# Altium schematic sheet up_floor.SchDoc
size A2
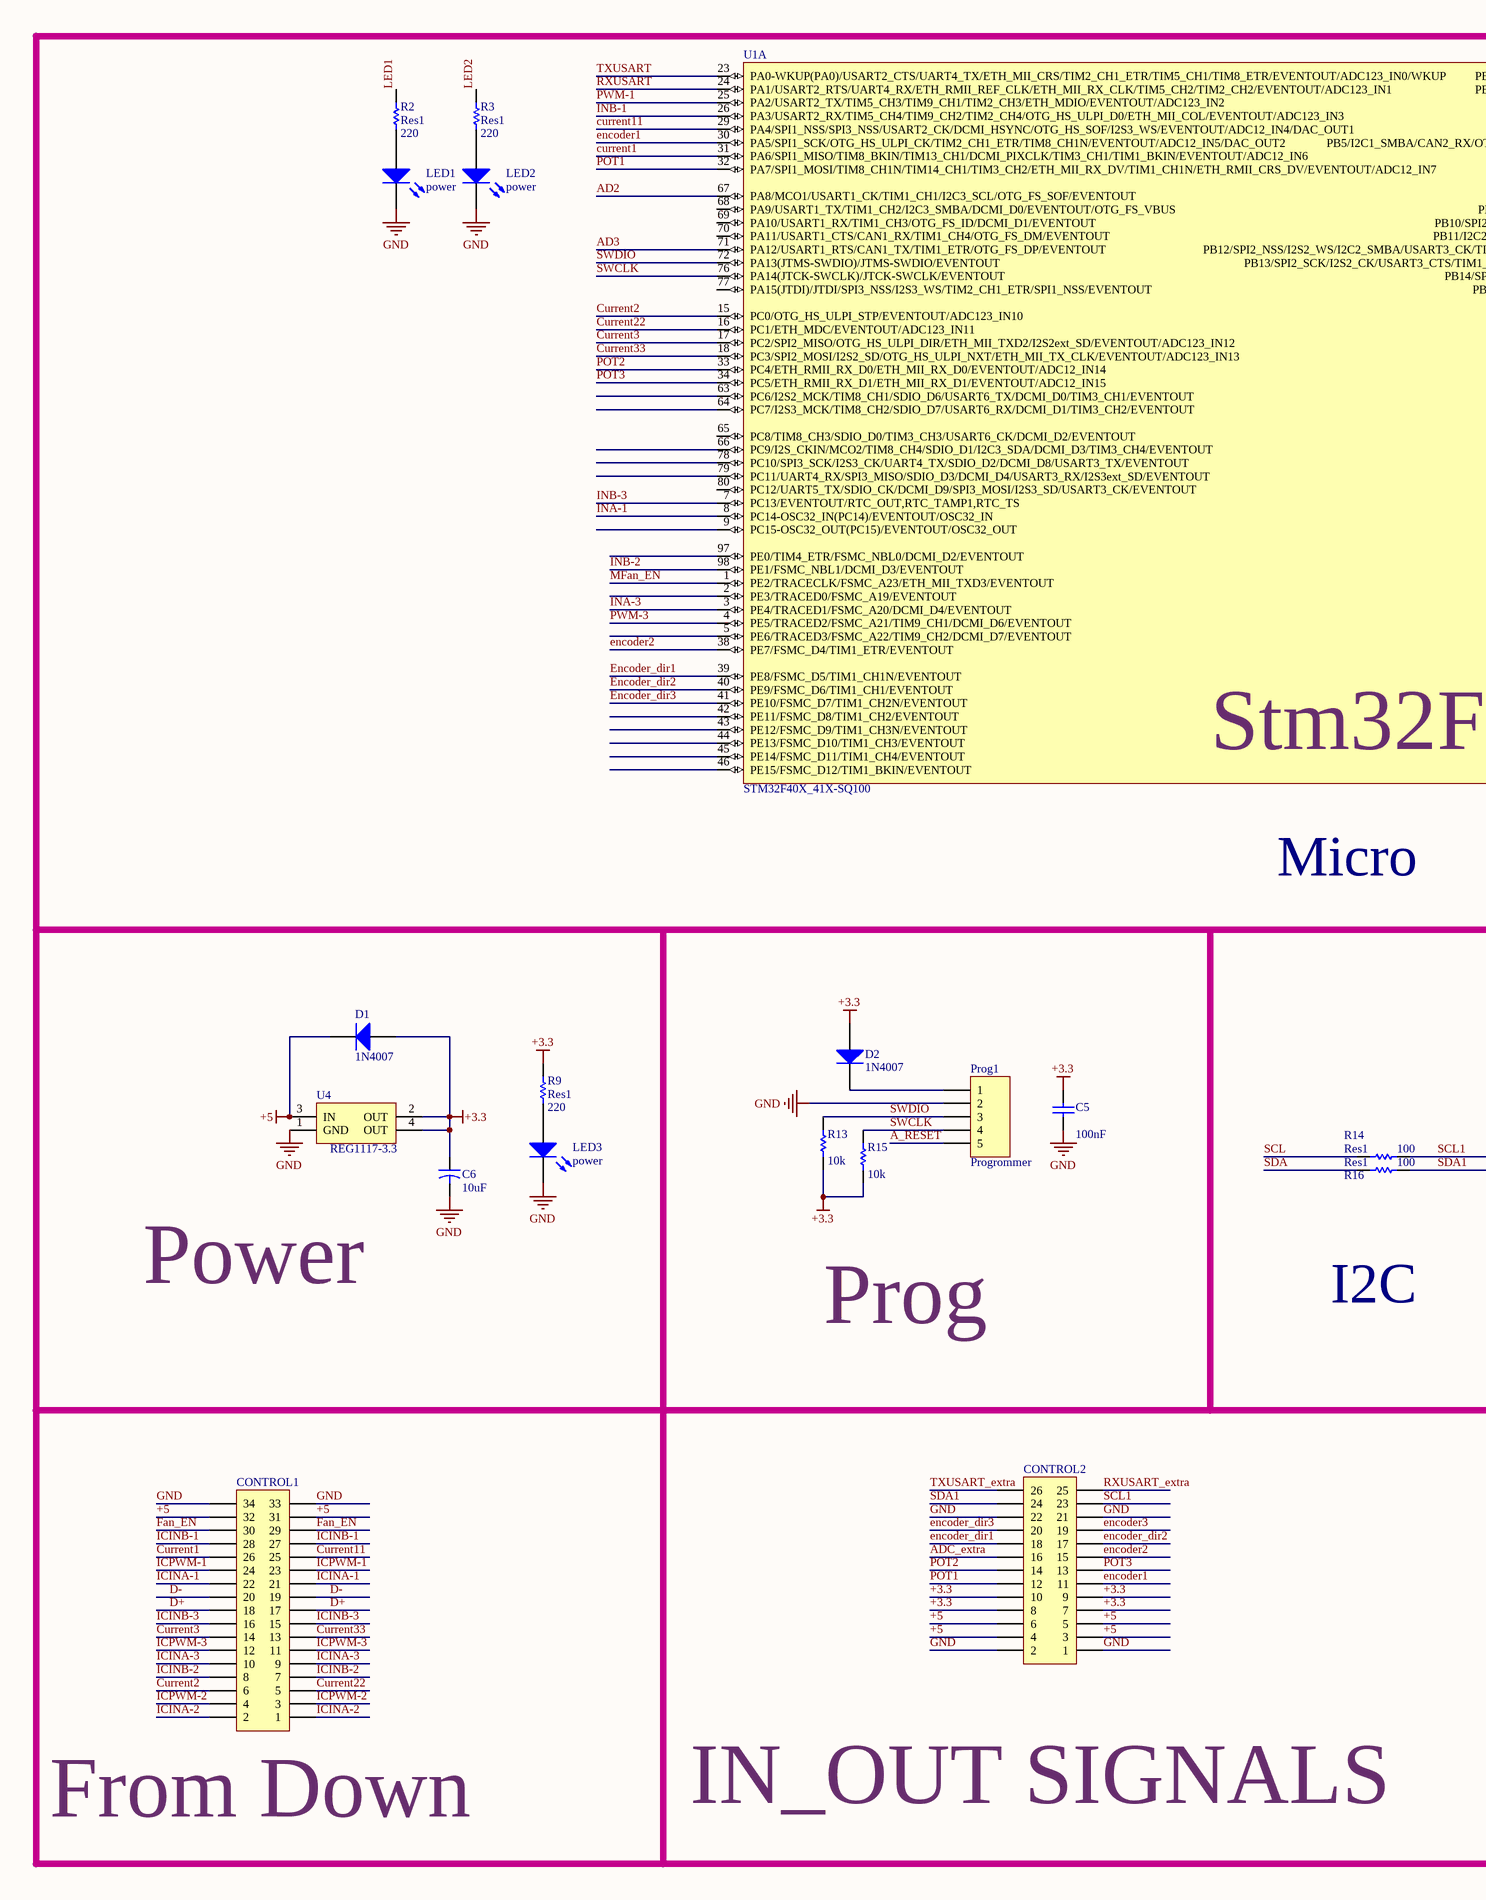
[diagram p0: up_floor.SchDoc, left]
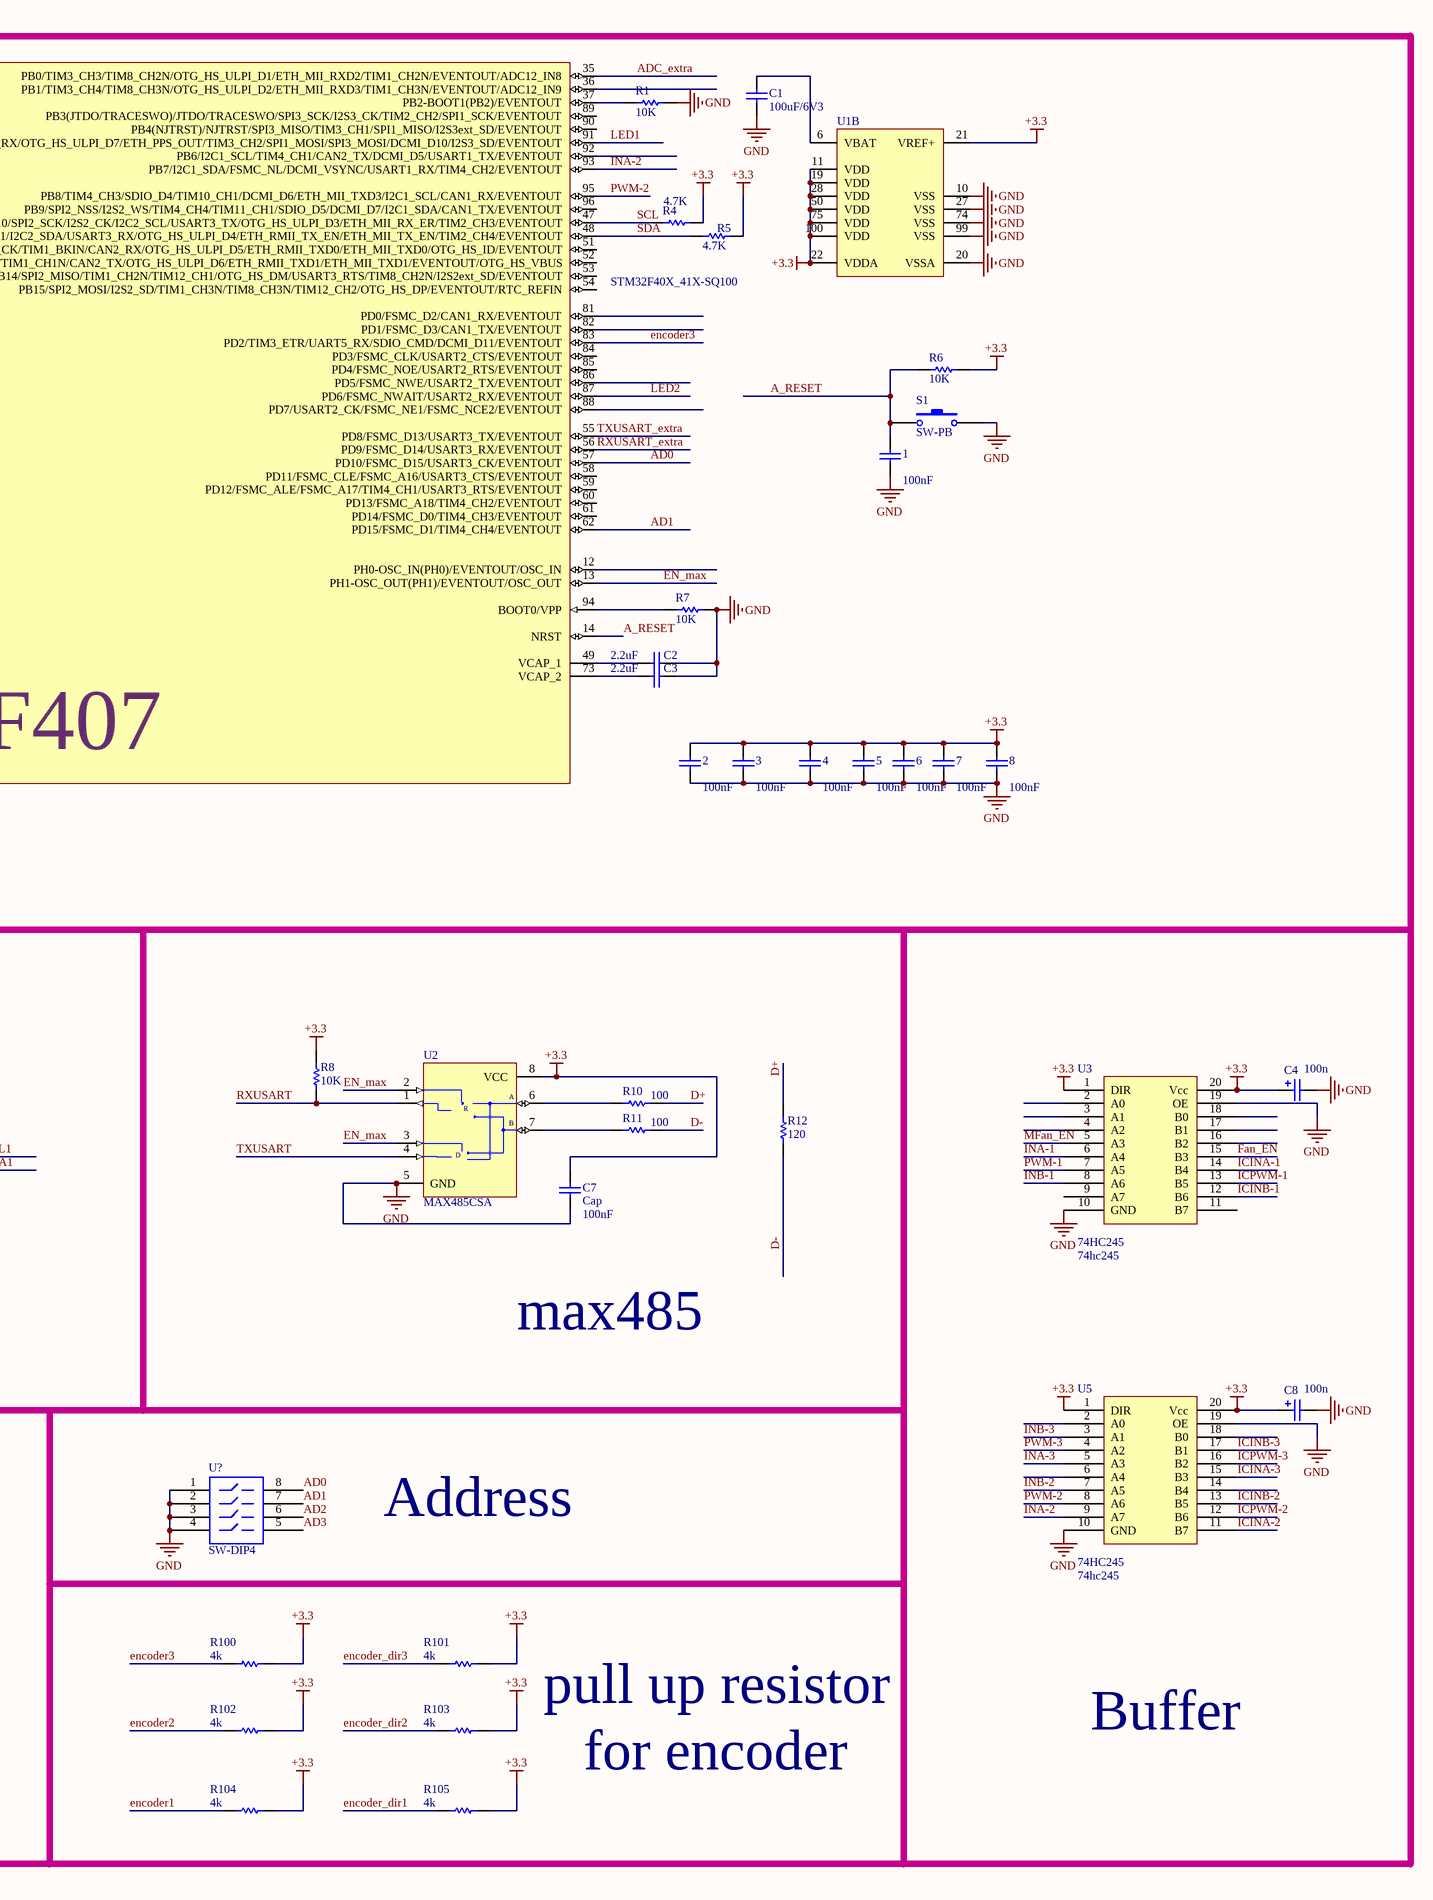
[diagram p1: up_floor.SchDoc, right]

## Parts
1  value 100nF  [j1-0603]
2  value 100nF  [j1-0603]
3  value 100nF  [j1-0603]
4  value 100nF  [j1-0603]
5  value 100nF  [j1-0603]
6  value 100nF  [j1-0603]
7  value 100nF  [j1-0603]
8  value 100nF  [j1-0603]
C1  100uF/6V3  [j1-0603]
C2  2.2uF  [j1-0603]
C3  2.2uF  [j1-0603]
C4  value 100n  [j1-0603]
C5  value 100nF  [j1-0603]
C6  value 10uF  [2012[0805]]  (hidden comment: Cap_El)
C7  Cap  value 100nF  [j1-0603]
C8  value 100n  [j1-0603]
CONTROL1  (no value)  [HDR2X17H]
CONTROL2  (no value)  [HDR2X13H]
D1  1N4007  [US1M]
D2  1N4007  [US1M]
LED1  power  [3518]
LED2  power  [3518]
LED3  power  [3518]
Prog1  Progrommer  [HDR1x5]
R1  10K  [J1-0603]
R2  Res1  value 220  [j1-0603]
R3  Res1  value 220  [j1-0603]
R4  4.7K  [J1-0603]
R5  4.7K  [J1-0603]
R6  10K  [J1-0603]
R7  10K  [J1-0603]
R8  value 10K  [j1-0603]  (hidden comment: Res1)
R9  Res1  value 220  [j1-0603]
R10  value 100  [j1-0603]  (hidden comment: Res1)
R11  value 100  [j1-0603]  (hidden comment: Res1)
R12  value 120  [j1-0603]  (hidden comment: Res1)
R13  value 10k  [J1-0603]
R14  Res1  value 100  [j1-0603]
R15  value 10k  [J1-0603]
R16  Res1  value 100  [j1-0603]
R100  4k  [j1-0603]
R101  4k  [j1-0603]
R102  4k  [j1-0603]
R103  4k  [j1-0603]
R104  4k  [j1-0603]
R105  4k  [j1-0603]
S1  SW-PB  [SW-PB-4P]
U1  STM32F40X_41X-SQ100  [100A_N]  (parts A,B of 2)
U2  MAX485CSA  [NSO8_N]
U3  74hc245  [74hc245]
U4  REG1117-3.3  [SOT223]
U5  74hc245  [74hc245]
U?  SW-DIP4  [SW_NUM_4PIN]

## Nets
+3.3: 2.2 3.2 4.2 5.2 6.2 7.2 8.2 C4.1 C5.2 C6.1 C7.2 C8.1 CONTROL2.7 CONTROL2.8 CONTROL2.9 CONTROL2.10 D1.1(A) D2.1(A) R4.1 R5.1 R6.1 R8.1 R9.1 R13.2 R15.2 R100.2 R101.2 R102.2 R103.2 R104.2 R105.2 U1.11(VDD) U1.19(VDD) U1.21(VREF+) U1.22(VDDA) U1.28(VDD) U1.50(VDD) U1.75(VDD) U1.100(VDD) U2.8(VCC) U3.1(DIR) U3.20(Vcc) U4.2(OUT) U4.4(OUT) U5.1(DIR) U5.20(Vcc)
+5: CONTROL1.31 CONTROL1.32 CONTROL2.3 CONTROL2.4 CONTROL2.5 CONTROL2.6 D1.2(K) U4.3(IN)
GND: 1.1 2.1 3.1 4.1 5.1 6.1 7.1 8.1 C1.1 C2.2 C3.2 C4.2 C5.1 C6.2 C7.1 C8.2 CONTROL1.33 CONTROL1.34 CONTROL2.1 CONTROL2.2 CONTROL2.21 CONTROL2.22 LED1.2(K) LED2.2(K) LED3.2(K) Prog1.2 R1.1 R7.1 S1.2 U1.10(VSS) U1.20(VSSA) U1.27(VSS) U1.74(VSS) U1.99(VSS) U2.5(GND) U3.10(GND) U3.19(OE) U4.1(GND) U5.10(GND) U5.19(OE) U?.1 U?.2 U?.3 U?.4
A_RESET: 1.2 Prog1.5 R6.2 S1.1 U1.14(NRST)
AD0: U1.57(PD10/FSMC_D15/USART3_CK/EVENTOUT) U?.8
AD1: U1.62(PD15/FSMC_D1/TIM4_CH4/EVENTOUT) U?.7
AD2: U1.67(PA8/MCO1/USART1_CK/TIM1_CH1/I2C3_SCL/OTG_FS_SOF/EVENTOUT) U?.6
AD3: U1.71(PA12/USART1_RTS/CAN1_TX/TIM1_ETR/OTG_FS_DP/EVENTOUT) U?.5
ADC_extra: CONTROL2.16 U1.35(PB0/TIM3_CH3/TIM8_CH2N/OTG_HS_ULPI_D1/ETH_MII_RXD2/TIM1_CH2N/EVENTOUT/ADC12_IN8)
Current1: CONTROL1.26 U1.31(PA6/SPI1_MISO/TIM8_BKIN/TIM13_CH1/DCMI_PIXCLK/TIM3_CH1/TIM1_BKIN/EVENTOUT/ADC12_IN6)
Current2: CONTROL1.6 U1.15(PC0/OTG_HS_ULPI_STP/EVENTOUT/ADC123_IN10)
Current3: CONTROL1.14 U1.17(PC2/SPI2_MISO/OTG_HS_ULPI_DIR/ETH_MII_TXD2/I2S2ext_SD/EVENTOUT/ADC123_IN12)
Current11: CONTROL1.25 U1.29(PA4/SPI1_NSS/SPI3_NSS/USART2_CK/DCMI_HSYNC/OTG_HS_SOF/I2S3_WS/EVENTOUT/ADC12_IN4/DAC_OUT1)
Current22: CONTROL1.5 U1.16(PC1/ETH_MDC/EVENTOUT/ADC123_IN11)
Current33: CONTROL1.13 U1.18(PC3/SPI2_MOSI/I2S2_SD/OTG_HS_ULPI_NXT/ETH_MII_TX_CLK/EVENTOUT/ADC123_IN13)
D+: CONTROL1.17 CONTROL1.18 R10.2 R12.1
D-: CONTROL1.19 CONTROL1.20 R11.2 R12.2
EN_max: U1.13(PH1-OSC_OUT(PH1)/EVENTOUT/OSC_OUT) U2.2(~{RE}) U2.3(DE)
encoder1: CONTROL2.11 R104.1 U1.30(PA5/SPI1_SCK/OTG_HS_ULPI_CK/TIM2_CH1_ETR/TIM8_CH1N/EVENTOUT/ADC12_IN5/DAC_OUT2)
encoder2: CONTROL2.15 R102.1 U1.38(PE7/FSMC_D4/TIM1_ETR/EVENTOUT)
encoder3: CONTROL2.19 R100.1 U1.83(PD2/TIM3_ETR/UART5_RX/SDIO_CMD/DCMI_D11/EVENTOUT)
encoder_dir1: CONTROL2.18 R105.1 U1.39(PE8/FSMC_D5/TIM1_CH1N/EVENTOUT)
encoder_dir2: CONTROL2.17 R103.1 U1.40(PE9/FSMC_D6/TIM1_CH1/EVENTOUT)
encoder_dir3: CONTROL2.20 R101.1 U1.41(PE10/FSMC_D7/TIM1_CH2N/EVENTOUT)
Fan_EN: CONTROL1.29 CONTROL1.30 U3.15(B3)
ICINA-1: CONTROL1.21 CONTROL1.22 U3.14(B4)
ICINA-2: CONTROL1.1 CONTROL1.2 U5.11(B7)
ICINA-3: CONTROL1.9 CONTROL1.10 U5.15(B3)
ICINB-1: CONTROL1.27 CONTROL1.28 U3.12(B6)
ICINB-2: CONTROL1.7 CONTROL1.8 U5.13(B5)
ICINB-3: CONTROL1.15 CONTROL1.16 U5.17(B1)
ICPWM-1: CONTROL1.23 CONTROL1.24 U3.13(B5)
ICPWM-2: CONTROL1.3 CONTROL1.4 U5.12(B6)
ICPWM-3: CONTROL1.11 CONTROL1.12 U5.16(B2)
INA-1: U1.8(PC14-OSC32_IN(PC14)/EVENTOUT/OSC32_IN) U3.6(A4)
INA-2: U1.93(PB7/I2C1_SDA/FSMC_NL/DCMI_VSYNC/USART1_RX/TIM4_CH2/EVENTOUT) U5.9(A7)
INA-3: U1.3(PE4/TRACED1/FSMC_A20/DCMI_D4/EVENTOUT) U5.5(A3)
INB-1: U1.26(PA3/USART2_RX/TIM5_CH4/TIM9_CH2/TIM2_CH4/OTG_HS_ULPI_D0/ETH_MII_COL/EVENTOUT/ADC123_IN3) U3.8(A6)
INB-2: U1.98(PE1/FSMC_NBL1/DCMI_D3/EVENTOUT) U5.7(A5)
INB-3: U1.7(PC13/EVENTOUT/RTC_OUT,RTC_TAMP1,RTC_TS) U5.3(A1)
LED1: R2.1 U1.91(PB5/I2C1_SMBA/CAN2_RX/OTG_HS_ULPI_D7/ETH_PPS_OUT/TIM3_CH2/SPI1_MOSI/SPI3_MOSI/DCMI_D10/I2S3_SD/EVENTOUT)
LED2: R3.1 U1.87(PD6/FSMC_NWAIT/USART2_RX/EVENTOUT)
MFan_EN: U1.1(PE2/TRACECLK/FSMC_A23/ETH_MII_TXD3/EVENTOUT) U3.5(A3)
POT1: CONTROL2.12 U1.32(PA7/SPI1_MOSI/TIM8_CH1N/TIM14_CH1/TIM3_CH2/ETH_MII_RX_DV/TIM1_CH1N/ETH_RMII_CRS_DV/EVENTOUT/ADC12_IN7)
POT2: CONTROL2.14 U1.33(PC4/ETH_RMII_RX_D0/ETH_MII_RX_D0/EVENTOUT/ADC12_IN14)
POT3: CONTROL2.13 U1.34(PC5/ETH_RMII_RX_D1/ETH_MII_RX_D1/EVENTOUT/ADC12_IN15)
PWM-1: U1.25(PA2/USART2_TX/TIM5_CH3/TIM9_CH1/TIM2_CH3/ETH_MDIO/EVENTOUT/ADC123_IN2) U3.7(A5)
PWM-2: U1.95(PB8/TIM4_CH3/SDIO_D4/TIM10_CH1/DCMI_D6/ETH_MII_TXD3/I2C1_SCL/CAN1_RX/EVENTOUT) U5.8(A6)
PWM-3: U1.4(PE5/TRACED2/FSMC_A21/TIM9_CH1/DCMI_D6/EVENTOUT) U5.4(A2)
RXUSART: R8.2 U1.24(PA1/USART2_RTS/UART4_RX/ETH_RMII_REF_CLK/ETH_MII_RX_CLK/TIM5_CH2/TIM2_CH2/EVENTOUT/ADC123_IN1) U2.1(RO)
RXUSART_extra: CONTROL2.25 U1.56(PD9/FSMC_D14/USART3_RX/EVENTOUT)
SCL: R4.2 R14.1 U1.47(PB10/SPI2_SCK/I2S2_CK/I2C2_SCL/USART3_TX/OTG_HS_ULPI_D3/ETH_MII_RX_ER/TIM2_CH3/EVENTOUT)
SCL1: CONTROL2.23 R14.2
SDA: R5.2 R16.1 U1.48(PB11/I2C2_SDA/USART3_RX/OTG_HS_ULPI_D4/ETH_RMII_TX_EN/ETH_MII_TX_EN/TIM2_CH4/EVENTOUT)
SDA1: CONTROL2.24 R16.2
SWCLK: Prog1.4 R15.1 U1.76(PA14(JTCK-SWCLK)/JTCK-SWCLK/EVENTOUT)
SWDIO: Prog1.3 R13.1 U1.72(PA13(JTMS-SWDIO)/JTMS-SWDIO/EVENTOUT)
TXUSART: U1.23(PA0-WKUP(PA0)/USART2_CTS/UART4_TX/ETH_MII_CRS/TIM2_CH1_ETR/TIM5_CH1/TIM8_ETR/EVENTOUT/ADC123_IN0/WKUP) U2.4(DI)
TXUSART_extra: CONTROL2.26 U1.55(PD8/FSMC_D13/USART3_TX/EVENTOUT)
NetC1_2: C1.2 U1.6(VBAT)
NetC2_1: C2.1 U1.49(VCAP_1)
NetC3_1: C3.1 U1.73(VCAP_2)
NetD2_2: D2.2(K) Prog1.1
NetLED1_1: LED1.1(A) R2.2
NetLED2_1: LED2.1(A) R3.2
NetLED3_1: LED3.1(A) R9.2
NetR1_2: R1.2 U1.37(PB2-BOOT1(PB2)/EVENTOUT)
NetR7_2: R7.2 U1.94(BOOT0/VPP)
NetR10_1: R10.1 U2.6(A)
NetR11_1: R11.1 U2.7(B)

Not connected (* = marked no-connect by the designer): U1 2(PE3/TRACED0/FSMC_A19/EVENTOUT) 5(PE6/TRACED3/FSMC_A22/TIM9_CH2/DCMI_D7/EVENTOUT) 9(PC15-OSC32_OUT(PC15)/EVENTOUT/OSC32_OUT) 12(PH0-OSC_IN(PH0)/EVENTOUT/OSC_IN) 36(PB1/TIM3_CH4/TIM8_CH3N/OTG_HS_ULPI_D2/ETH_MII_RXD3/TIM1_CH3N/EVENTOUT/ADC12_IN9) 42(PE11/FSMC_D8/TIM1_CH2/EVENTOUT) 43(PE12/FSMC_D9/TIM1_CH3N/EVENTOUT) 44(PE13/FSMC_D10/TIM1_CH3/EVENTOUT) 45(PE14/FSMC_D11/TIM1_CH4/EVENTOUT) 46(PE15/FSMC_D12/TIM1_BKIN/EVENTOUT) 51(PB12/SPI2_NSS/I2S2_WS/I2C2_SMBA/USART3_CK/TIM1_BKIN/CAN2_RX/OTG_HS_ULPI_D5/ETH_RMII_TXD0/ETH_MII_TXD0/OTG_HS_ID/EVENTOUT) 52(PB13/SPI2_SCK/I2S2_CK/USART3_CTS/TIM1_CH1N/CAN2_TX/OTG_HS_ULPI_D6/ETH_RMII_TXD1/ETH_MII_TXD1/EVENTOUT/OTG_HS_VBUS) 53(PB14/SPI2_MISO/TIM1_CH2N/TIM12_CH1/OTG_HS_DM/USART3_RTS/TIM8_CH2N/I2S2ext_SD/EVENTOUT) 54(PB15/SPI2_MOSI/I2S2_SD/TIM1_CH3N/TIM8_CH3N/TIM12_CH2/OTG_HS_DP/EVENTOUT/RTC_REFIN) 58(PD11/FSMC_CLE/FSMC_A16/USART3_CTS/EVENTOUT) 59(PD12/FSMC_ALE/FSMC_A17/TIM4_CH1/USART3_RTS/EVENTOUT) 60(PD13/FSMC_A18/TIM4_CH2/EVENTOUT) 61(PD14/FSMC_D0/TIM4_CH3/EVENTOUT) 63(PC6/I2S2_MCK/TIM8_CH1/SDIO_D6/USART6_TX/DCMI_D0/TIM3_CH1/EVENTOUT) 64(PC7/I2S3_MCK/TIM8_CH2/SDIO_D7/USART6_RX/DCMI_D1/TIM3_CH2/EVENTOUT) 65(PC8/TIM8_CH3/SDIO_D0/TIM3_CH3/USART6_CK/DCMI_D2/EVENTOUT) 66(PC9/I2S_CKIN/MCO2/TIM8_CH4/SDIO_D1/I2C3_SDA/DCMI_D3/TIM3_CH4/EVENTOUT) 68(PA9/USART1_TX/TIM1_CH2/I2C3_SMBA/DCMI_D0/EVENTOUT/OTG_FS_VBUS) 69(PA10/USART1_RX/TIM1_CH3/OTG_FS_ID/DCMI_D1/EVENTOUT) 70(PA11/USART1_CTS/CAN1_RX/TIM1_CH4/OTG_FS_DM/EVENTOUT) 77(PA15(JTDI)/JTDI/SPI3_NSS/I2S3_WS/TIM2_CH1_ETR/SPI1_NSS/EVENTOUT) 78(PC10/SPI3_SCK/I2S3_CK/UART4_TX/SDIO_D2/DCMI_D8/USART3_TX/EVENTOUT) 79(PC11/UART4_RX/SPI3_MISO/SDIO_D3/DCMI_D4/USART3_RX/I2S3ext_SD/EVENTOUT) 80(PC12/UART5_TX/SDIO_CK/DCMI_D9/SPI3_MOSI/I2S3_SD/USART3_CK/EVENTOUT) 81(PD0/FSMC_D2/CAN1_RX/EVENTOUT) 82(PD1/FSMC_D3/CAN1_TX/EVENTOUT) 84(PD3/FSMC_CLK/USART2_CTS/EVENTOUT) 85(PD4/FSMC_NOE/USART2_RTS/EVENTOUT) 86(PD5/FSMC_NWE/USART2_TX/EVENTOUT) 88(PD7/USART2_CK/FSMC_NE1/FSMC_NCE2/EVENTOUT) 89(PB3(JTDO/TRACESWO)/JTDO/TRACESWO/SPI3_SCK/I2S3_CK/TIM2_CH2/SPI1_SCK/EVENTOUT) 90(PB4(NJTRST)/NJTRST/SPI3_MISO/TIM3_CH1/SPI1_MISO/I2S3ext_SD/EVENTOUT) 92(PB6/I2C1_SCL/TIM4_CH1/CAN2_TX/DCMI_D5/USART1_TX/EVENTOUT) 96(PB9/SPI2_NSS/I2S2_WS/TIM4_CH4/TIM11_CH1/SDIO_D5/DCMI_D7/I2C1_SDA/CAN1_TX/EVENTOUT) 97(PE0/TIM4_ETR/FSMC_NBL0/DCMI_D2/EVENTOUT); U3 2(A0) 3(A1) 4(A2) 9(A7) 11(B7) 16(B2) 17(B1) 18(B0); U5 2(A0) 6(A4) 14(B4) 18(B0)

## Notes on the sheet
- (near U1) Stm32F407
- Micro
- Power
- Prog
- I2C
- max485
- Address
- pull up resistor
- Buffer
- IN_OUT SIGNALS
- for encoder
- (near CONTROL1) From Down
- (in symbol 74hc245) 74HC245
- (in symbol MAX485CSA) R; D

## Library data of the parts
1-8 C5 = Cap: Capacitor; Manufacturer: Generic Components; Class: Passive; Published: 08/06/2000; Publisher: Altium Hobart Technology Centre; SubClass: Capacitor
C1 = Cap: Capacitor; Value: 100nF; Published: 8-Jun-2000; LatestRevisionDate: 17-Jul-2002; LatestRevisionNote: Re-released for DXP Platform.; PackageReference: RAD-0.3; Publisher: Altium Limited
C2 C3 = Cap_UP: Capacitor; Published: 8-Jun-2000; LatestRevisionDate: 17-Jul-2002; LatestRevisionNote: Re-released for DXP Platform.; PackageReference: RAD-0.3; Publisher: Altium Limited; Value: 2.2uF
C4 C8 = Cap Pol1: Polarized Capacitor (Radial); Manufacturer: Generic Components; Class: Passive; Published: 08/06/2000; Publisher: Altium Hobart Technology Centre; SubClass: Capacitor
C6 = Cap_El: Capacitor; Published: 23-Sep-2002; PackageReference: CAPR5-4X5; Publisher: Altium Limited
C7 = Cap: Capacitor; Published: 8-Jun-2000; LatestRevisionDate: 17-Jul-2002; LatestRevisionNote: Re-released for DXP Platform.; PackageReference: RAD-0.3; Publisher: Altium Limited
CONTROL1 = Header 17X2H: Header, 17-Pin, Dual row, Right Angle; LatestRevisionDate: 17-Jul-2002; LatestRevisionNote: Re-released for DXP Platform.; Publisher: Altium Limited
CONTROL2 = Header 13X2H: Header, 13-Pin, Dual row, Right Angle; LatestRevisionDate: 17-Jul-2002; LatestRevisionNote: Re-released for DXP Platform.; Publisher: Altium Limited
D1 D2 = Diode: 1 Amp General Purpose Rectifier; Revision 1: 11-Jul-2000: SIM Model Added.; Revision 2: 17-Jul-2002: Re-released for DXP Platform.; Package Information: Latest Revision: Aug-1999; Code - JEDEC: DO-204-AL; Published: 8-Jun-2000; Datasheet: Latest Revision: 1998; Package Reference: DO-41; Publisher: Altium Limited
LED1-LED3 = LED3: Typical BLUE SiC LED; pin to pad: 1>2 2>1; Published: 8-Jun-2000; LatestRevisionDate: 17-Dec-2003; LatestRevisionNote: PCB Footprint replaced.; DatasheetDocument: 16-Apr-2002; PackageDocument: 16-Apr-2002; PackageReference: 3.5X2.8X1.9; Publisher: Altium Limited
Prog1 = Header 5: Header, 5-Pin; LatestRevisionDate: 17-Jul-2002; LatestRevisionNote: Re-released for DXP Platform.; Publisher: Altium Limited
R1 R4-R7 = Res1: Resistor; Value: 1K; Published: 8-Jun-2000; LatestRevisionDate: 17-Jul-2002; LatestRevisionNote: Re-released for DXP Platform.; PackageReference: AXIAL-0.3; Publisher: Altium Limited
R2 R3 R8-R12 R14 R16 R100-R105 = Res1: Resistor; Published: 8-Jun-2000; LatestRevisionDate: 17-Jul-2002; LatestRevisionNote: Re-released for DXP Platform.; PackageReference: AXIAL-0.3; Publisher: Altium Limited
R13 R15 = Res: Semiconductor Resistor; Published: 8-Jun-2000; LatestRevisionDate: 17-Jul-2002; LatestRevisionNote: Re-released for DXP Platform.; PackageReference: AXIAL-0.5; Publisher: Altium Limited
S1 = SW-PB: Switch; Published: 24-Mar-1999; LatestRevisionDate: 17-Jul-2002; LatestRevisionNote: Re-released for DXP Platform.; PackageReference: SPST-2; Publisher: Altium Limited
U2 = MAX485CSA: Low-Power, Slew-Rate-Limited RS-485/RS-422 Transceiver; Published: 16-Jan-2001; LatestRevisionDate: 13-Apr-2006; LatestRevisionNote: IPC-7351 Footprint Added.; DatasheetVersion: Feb-1996; PackageReference: NSO8; Publisher: Altium Limited; PackageDescription: 8-Pin Small Outline Integrated Circuit 1.27 mm Pitch; Code_JEDEC: MS-012-AA; Code_IPC: SOIC127P600-8; ComponentLink1Description: Manufacturer Link; ComponentLink1URL: http://www.maxim-ic.com/; ComponentLink2Description: Datasheet; ComponentLink2URL: http://pdfserv.maxim-ic.com/en/ds/MAX1487-MAX491.pdf
U4 = REG1117-3.3: 800mA and 1A Low Dropout Positive Regulator 2.85V, 3.3V, 5V, and Adjustable; Published: 8-Jun-2000; LatestRevisionDate: 17-Jul-2002; LatestRevisionNote: Re-released for DXP Platform.; DatasheetVersion: Sep-1997; PackageVersion: revC; PackageReference: ZZ311; Publisher: Altium Limited; PackageDescription: SOT-223/SC-73; 4 Leads; Body 6.7 x 7.3 mm, inc. leads (LxW max); ComponentLink1Description: Manufacturer Link; ComponentLink1URL: http://www.ti.com/; ComponentLink2Description: Datasheet; ComponentLink2URL: http://www-s.ti.com/sc/ds/REG1117.pdf